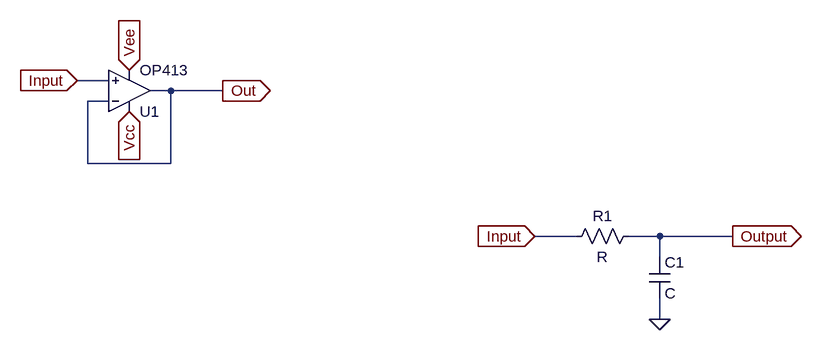
[diagram p0: schematic Draft3.asc]
Draft3.asc, the LTspice schematic file:
Version 4
SHEET 1 880 680
WIRE -688 -128 -736 -128
WIRE -592 -112 -624 -112
WIRE -512 -112 -592 -112
WIRE -688 -96 -720 -96
WIRE -720 0 -720 -96
WIRE -592 0 -592 -112
WIRE -592 0 -720 0
WIRE 32 112 -32 112
WIRE 160 112 112 112
WIRE 272 112 160 112
WIRE 160 144 160 112
WIRE 160 240 160 208
FLAG 160 240 0
FLAG 272 112 Output
IOPIN 272 112 Out
FLAG -32 112 Input
IOPIN -32 112 In
FLAG -656 -80 Vcc
IOPIN -656 -80 In
FLAG -656 -144 Vee
IOPIN -656 -144 In
FLAG -736 -128 Input
IOPIN -736 -128 In
FLAG -512 -112 Out
IOPIN -512 -112 Out
SYMBOL res 128 96 R90
WINDOW 0 0 56 VBottom 2
WINDOW 3 32 56 VTop 2
SYMATTR InstName R1
SYMBOL cap 144 144 R0
SYMATTR InstName C1
SYMBOL OpAmps\\OP413 -656 -48 M180
SYMATTR InstName U1

The netlist it stands for:
* Draft3.asc
R1 Output Input R
C1 Output 0 C
XU1 Input Out Vcc Vee Out OP413  ; pins In+ In- V+ V- OUT
.backanno
.end